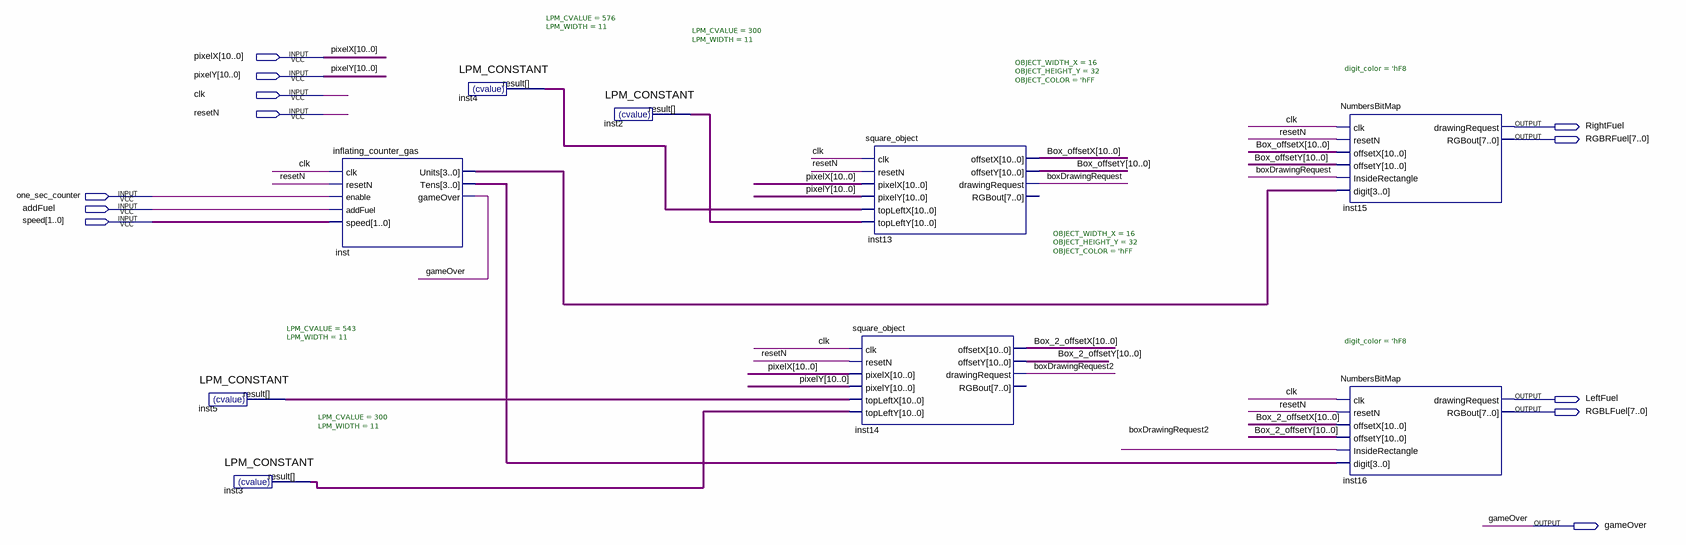
[diagram p0: schematic sheet]
// Quartus schematic gasDisplay.bdf as structural Verilog: 9 symbols, 12 pins
module gasDisplay (
  input  [10:0] pixelX,
  input  [10:0] pixelY,
  input  clk,
  input  resetN,
  input  one_sec_counter,
  input  addFuel,
  input  [1:0] speed,
  output RightFuel,
  output [7:0] RGBRFuel,
  output LeftFuel,
  output [7:0] RGBLFuel,
  output gameOver
);

  wire boxDrawingRequest, boxDrawingRequest2;
  wire [3:0] inst_tens, inst_units;
  wire [10:0] Box_2_offsetX, Box_2_offsetY, Box_offsetX, Box_offsetY, inst2_result, inst3_result,
       inst4_result, inst5_result;

  LPM_CONSTANT #(.LPM_CVALUE(543), .LPM_WIDTH(11)) inst5 (.result(inst5_result));
  LPM_CONSTANT #(.LPM_CVALUE(300), .LPM_WIDTH(11)) inst3 (.result(inst3_result));
  inflating_counter_gas inst (
    .clk(clk), .resetN(resetN), .enable(one_sec_counter), .addFuel(addFuel), .speed(speed),
    .Units(inst_units), .Tens(inst_tens), .gameOver(gameOver));
  LPM_CONSTANT #(.LPM_CVALUE(576), .LPM_WIDTH(11)) inst4 (.result(inst4_result));
  LPM_CONSTANT #(.LPM_CVALUE(300), .LPM_WIDTH(11)) inst2 (.result(inst2_result));
  square_object #(.OBJECT_WIDTH_X(16), .OBJECT_HEIGHT_Y(32), .OBJECT_COLOR('hFF)) inst13 (
    .clk(clk), .resetN(resetN), .pixelX(pixelX), .pixelY(pixelY), .topLeftX(inst4_result),
    .topLeftY(inst2_result), .offsetX(Box_offsetX), .offsetY(Box_offsetY), .drawingRequest(boxDrawingRequest));  // open: RGBout
  square_object #(.OBJECT_WIDTH_X(16), .OBJECT_HEIGHT_Y(32), .OBJECT_COLOR('hFF)) inst14 (
    .clk(clk), .resetN(resetN), .pixelX(pixelX), .pixelY(pixelY), .topLeftX(inst5_result),
    .topLeftY(inst3_result), .offsetX(Box_2_offsetX), .offsetY(Box_2_offsetY),
    .drawingRequest(boxDrawingRequest2));  // open: RGBout
  NumbersBitMap #(.digit_color('hF8)) inst15 (
    .clk(clk), .resetN(resetN), .offsetX(Box_offsetX), .offsetY(Box_offsetY),
    .InsideRectangle(boxDrawingRequest), .digit(inst_units), .drawingRequest(RightFuel), .RGBout(RGBRFuel));
  NumbersBitMap #(.digit_color('hF8)) inst16 (
    .clk(clk), .resetN(resetN), .offsetX(Box_2_offsetX), .offsetY(Box_2_offsetY),
    .InsideRectangle(boxDrawingRequest2), .digit(inst_tens), .drawingRequest(LeftFuel), .RGBout(RGBLFuel));
endmodule
